# EAGLE design brake-light-tester (EAGLE 7.3.0)
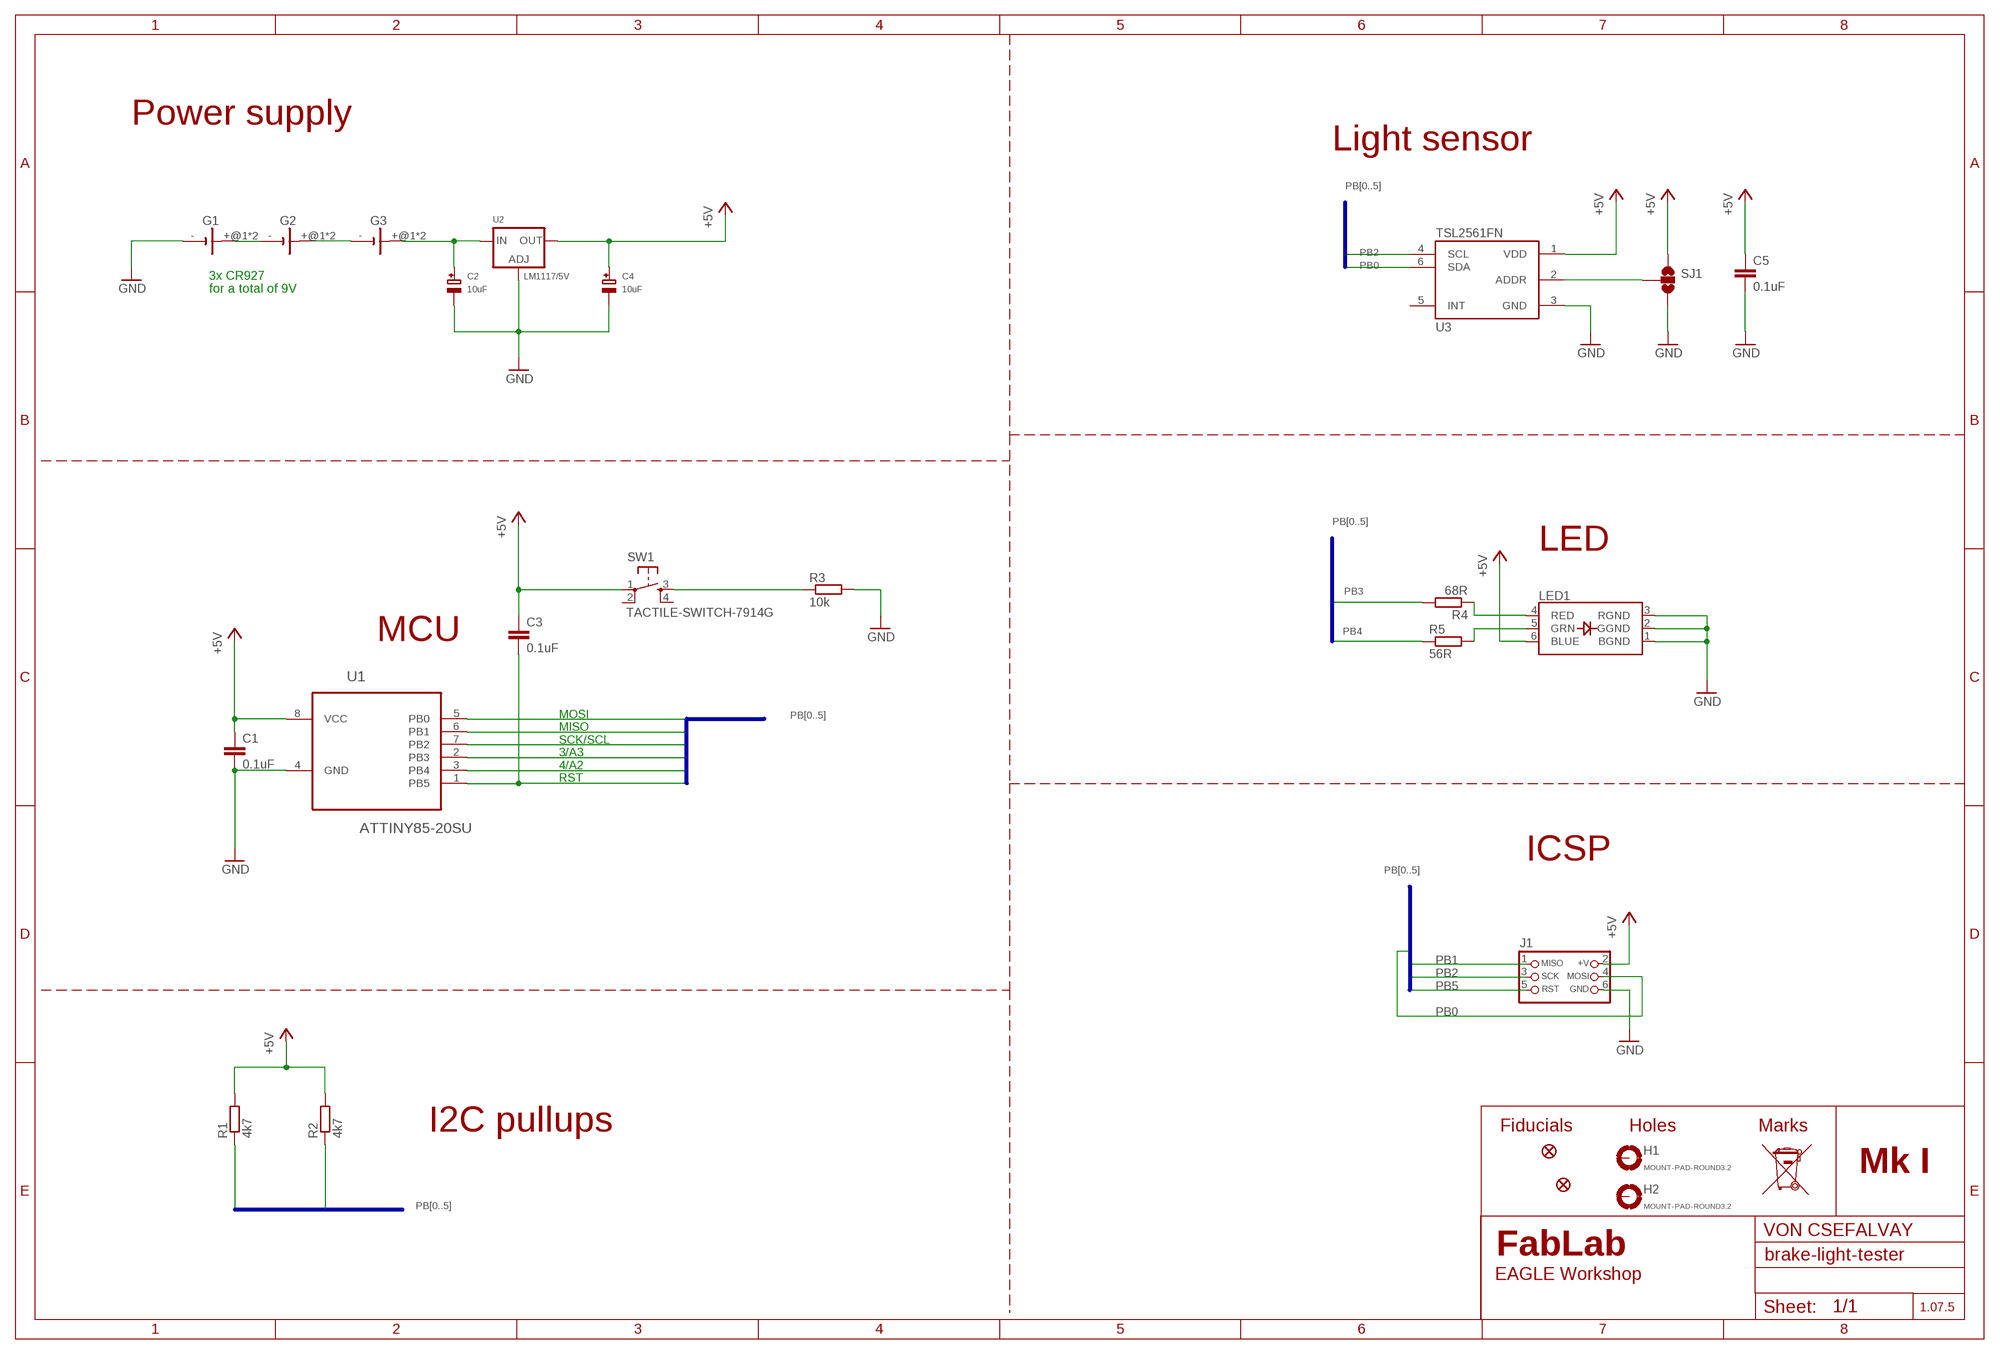
[diagram p0: schematic, sheet 1]

## Parts
C1  0.1uF  C-EUC1210  [C1210]
C2  10uF  CAP_TANTALUMC/6032_REFLOW  [EIA6032-28/C-R]
C3  0.1uF  C-EUC1206  [C1206]
C4  10uF  CAP_TANTALUMC/6032_REFLOW  [EIA6032-28/C-R]
C5  0.1uF  C-EUC1210  [C1210]
FID1  FIDUCIALROUND  [PASS-ROUND]
FID2  FIDUCIALROUND  [PASS-ROUND]
G1  10MM_SM_COIN_CELL_CLIP  [10MM_SM_COIN_CELL_CLIP]
G2  10MM_SM_COIN_CELL_CLIP  [10MM_SM_COIN_CELL_CLIP]
G3  10MM_SM_COIN_CELL_CLIP  [10MM_SM_COIN_CELL_CLIP]
H1  MOUNT-PAD-ROUND3.2  [3,2-PAD]
H2  MOUNT-PAD-ROUND3.2  [3,2-PAD]
J1  CON_HEADER_PRG_AVR_ICSP-SMD  [M2X3_SMD]
LED1  LED_RGB_PLCC6CREE-CLV6A  [RGBLED_PLCC6]
R1  4k7  R-EU_R1206  [R1206]
R2  4k7  R-EU_R1206  [R1206]
R3  10k  R-EU_R1206  [R1206]
R4  68R  R-EU_R1206  [R1206]
R5  56R  R-EU_R1206  [R1206]
SJ1  SOLDERJUMPER_2WAYPASTE1&2  [SJ_3_PASTE1&2]
SW1  TACTILE-SWITCH-7914G  [7914G]
U1  ATTINY85-20SU  [SOIC127P798X216-8N]
U2  LM1117/5V  LM1117SOT223-REFLOW  [SOT223-R]
U3  TSL2561FN  [FN-6]

## Nets
+5V: C1.1 C3.1 C4.+ C5.1 J1.2(+V) LED1.6(BLUE) R1.2 R2.2 SJ1.1 SW1.1 U1.8(VCC) U2.2(OUT) U3.1(VDD)
GND: C1.2 C2.- C4.- C5.2 G1.- J1.6(GND) LED1.1(BGND) LED1.2(GGND) LED1.3(RGND) R3.2 SJ1.3 U1.4(GND) U2.1(ADJ) U3.3(GND)
N$1: C2.+ G3.+@1(+) G3.+@2(+) U2.3(IN)
N$2: SJ1.2 U3.2(ADDR)
N$3: LED1.4(RED) R4.1
N$4: LED1.5(GRN) R5.2
N$5: G1.+@1(+) G1.+@2(+) G2.-
N$6: G2.+@1(+) G2.+@2(+) G3.-
N$7: R3.1 SW1.3
PB0: J1.4(MOSI) R1.1 U1.5(PB0) U3.6(SDA)
PB1: J1.1(MISO) U1.6(PB1)
PB2: J1.3(SCK) R2.1 U1.7(PB2) U3.4(SCL)
PB3: R4.2 U1.2(PB3)
PB4: R5.1 U1.3(PB4)
PB5: C3.2 J1.5(RST) U1.1(PB5)
Unconnected: H1.B3,2(MOUNT) H2.B3,2(MOUNT) SW1.2 SW1.4 U3.5(INT)

## Buses
PB[0..5]

## Notes on the sheet
- Power supply
- Light sensor
- 3x CR927
- for a total of 9V
- LED
- MCU
- MOSI
  MISO
  SCK/SCL
  3/A3
  4/A2
  RST
- ICSP
- I2C pullups | Fiducials | Holes | Marks
- Mk I
- VON CSEFALVAY
- FabLab
- EAGLE Workshop
- 1.07.5

## Library data of the parts
C1 C3 C5 = rcl:C-EU: CAPACITOR, European symbol; MF: TDK; MPN: CGA5L2C0G1H104J160AA; OC_FARNELL: 2211074
C2 C4 = microbuilder:CAP_TANTALUM: Tantalum Capacitors Wave footprints have larger pads and are meant to be used for hand soldering. Reflow footprints are optimised for solder paste and a reflow oven. EIA3216-18/A-[R/W] - Size A / 3216-18 / 1206 footprint 4.7µF 25V 10% Tantalum Capacitor 10µF 16V 10% Tantalum Capacitor [Digikey: 495-2236-2-ND] EIA3528-21/B-[R/W] - Size B / 3528-21 47µF 10V 10% Tantalum Capactior [Digikey: 495-2216-1-ND] EIA6032-28/C-[R/W] - Size C / 6032-28 10µF 35V 20% Tantalum Capacitor [Digikey: 495-2285-1-ND] 100µF 16V 10% Tantalum Capactior [Digikey: 399-5214-1-ND]; MF: AVX; MPN: TAJA106K010RNJ; OC_FARNELL: 197130
FID1 FID2 = microbuilder:FIDUCIAL: Fiducial Alignment Points Various fiducial points for machine vision alignment.; OC_FARNELL: unknown
G1-G3 = battery:10MM_SM_COIN_CELL_CLIP: Battery cell clip for CR927 Source: KEYSTONE ELECTRONICS CORP. www.keyelco.com, ASTORIA, N.Y. 11105-2017 PART ANME 10mm SM COIN CELl CLIP DWG NO. 3030; OC_FARNELL: unknown
H1 H2 = holes:MOUNT-PAD-ROUND: MOUNTING PAD, round; OC_FARNELL: unknown
J1 = dp_devices:CON_HEADER_PRG_AVR_ICSP: 2x3 AVR ICSP programming header; OC_FARNELL: unknown
LED1 = microbuilder:LED_RGB_PLCC6: RGB LED Cree CLV6A-FKB - Digikey: CLV6A-FKB-CK1P1G1BB7R3R3TR-ND DC Foreward Current: 20mA Foreward Voltage: R = 2.0, G = 3.2, B = 3.2 Viewing Angle: 120°; OC_FARNELL: unknown
R1 R2 = rcl:R-EU_: RESISTOR, European symbol; MF: MULTICOMP; MPN: MCHP06W2F4701T5E; OC_FARNELL: 1576638
R3 = rcl:R-EU_: RESISTOR, European symbol; MF: VISHAY DRALORIC; MPN: CRCW120610K0FKEA; OC_FARNELL: 1469970
R4 = rcl:R-EU_: RESISTOR, European symbol; MF: YAGEO (PHYCOMP); MPN: RL1206FR-7W0R68L; OC_FARNELL: 8067635
R5 = rcl:R-EU_: RESISTOR, European symbol; MF: PANASONIC ELECTRONIC COMPONENTS; MPN: ERJ8GEYJ560V; OC_FARNELL: 2057808
SJ1 = SparkFun-Retired:SOLDERJUMPER_2WAY: Solder Jumper 2 way solder jumper; OC_FARNELL: unknown
SW1 = GeekAmmo:TACTILE-SWITCH: Tactile Switch 4 Pins, SPST NO; OC_FARNELL: unknown
U1 = Atmel_By_element14_Batch_1-00:ATTINY85-20SU: 8-bit Microcontroller with In-System Programmable Flash; MF: ATMEL; MPN: ATTINY85-20SU; OC_FARNELL: 1455164; OC_NEWARK: 58M3797; PACKAGE: SOIC-8; SUPPLIER: Atmel
U2 = microbuilder:LM1117: LM1117 Voltage Regulator LM1117 Adjustable Voltage regulator [Digikey: LM1117IMP-ADJDKR-ND] LM1117 3.3V Voltage regulator [AP1117E33GDIDKR-ND] LM1117 5.0V Voltage regulator [AP1117E50GDIDKR-ND] SOT223-REFLOW - SOT223 package for solder paste/reflow ovens SOT223-WAVE - SOT223 package for hand-soldering (larger pads) Note: For the fixed-voltage regulators, simply set the ADJ pin to GND.; OC_FARNELL: unknown
U3 = SparkFun-DigitalIC:TSL2561: TSL2561 illumination sensor Approximates Human Eye Response Precisely Measures Illuminance Programmable Interrupt Function with User-Defined Upper and Lower Threshold 400 KHz I2C interface Programmable Analog Gain and Integration Time Supporting 1,000,000-to-1 Dynamic Range Automatically Rejects 50/60-Hz Lighting Ripple Low Active Power (0.75 mW Typical) with Power Down Mode RoHS Compliant The TSL2561 is a light-to-digital converter that transform light intensity to a digital signal output via I2C interface. The device combines one broadband photodiode (visible plus infrared) and one infrared-responding photodiode on a single CMOS integrated circuit capable of providing a near-photopic response over an effective 20-bit dynamic range (16-bit resolution). Two integrating ADCs convert the photodiode currents to a digital output that represents the irradiance measured on each channel. This digital output can be input to a microprocessor where illuminance (ambient light level) in lux is derived using an empirical formula to approximate the human eye response. The TSL2561 device supports a traditional level style interrupt that remains asserted until the firmware clears it.; OC_FARNELL: unknown; PROD_ID: IC-11791

## Board
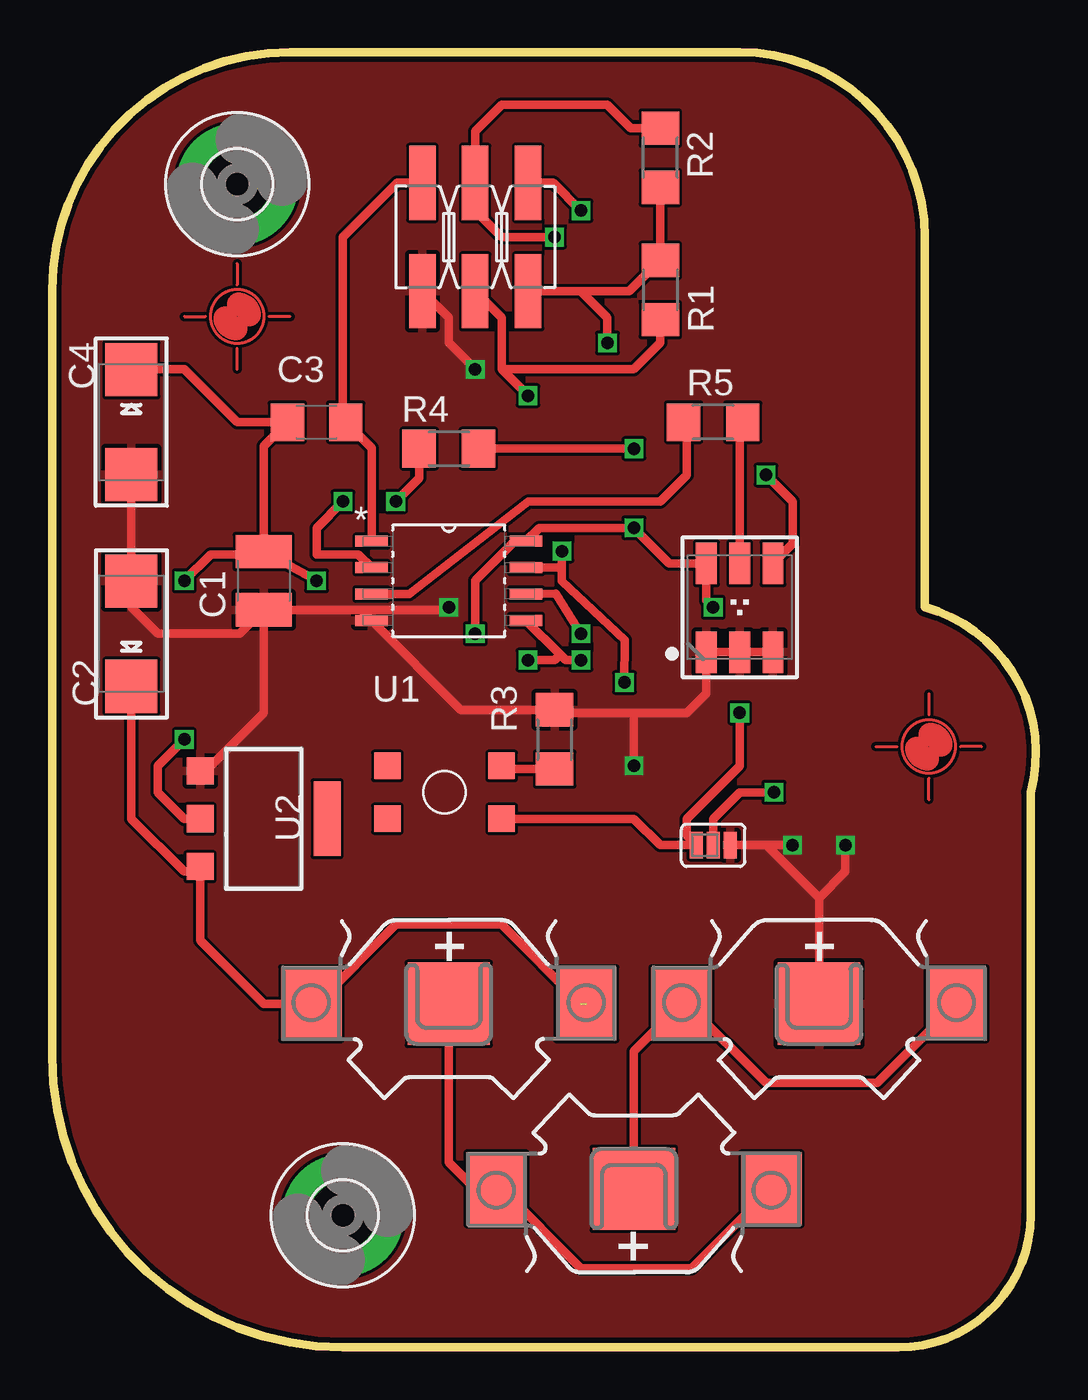
[diagram p1: board, top side]
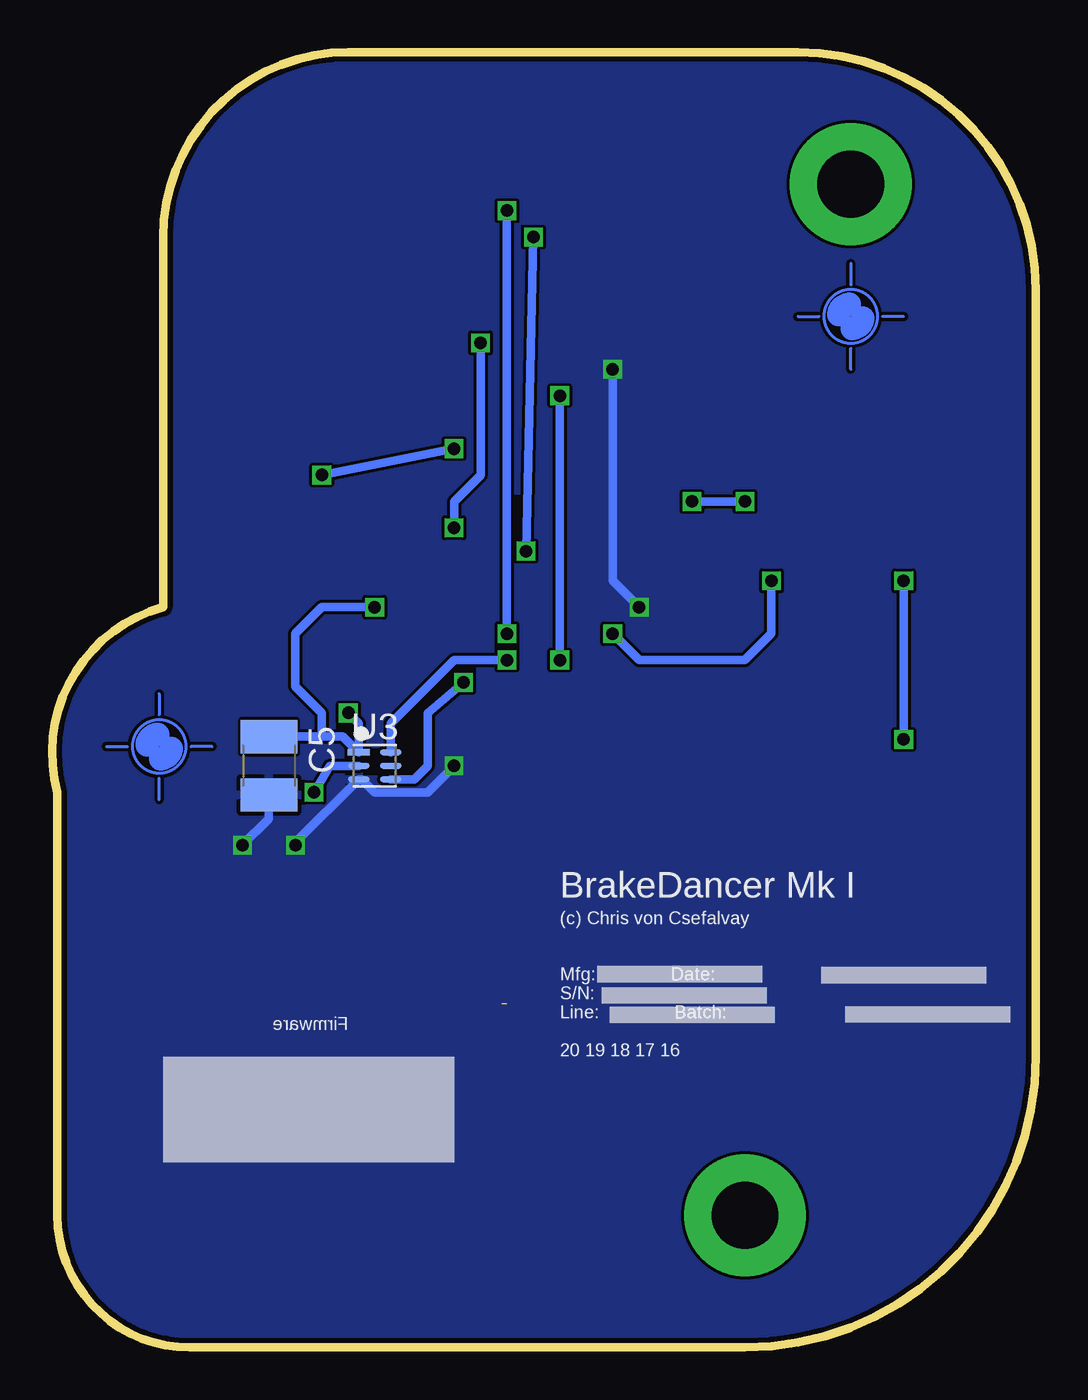
[diagram p2: board, bottom side, seen from below]

Size 47.24 x 62.23 mm. Coordinates in mm from the lower left corner, seen from the top.
Outline: 13.97,0 arc-90 0,13.97 0,50.8 arc-90 11.43,62.23 33.02,62.23 arc-90 41.91,53.34 41.91,35.56 arc-90 46.99,26.67 46.99,6.35 arc-90 40.64,0 13.97,0
Copper layers (1*16): Top 0.018mm / dielectric 1.55mm / Bottom 0.018mm
Design rules "eC_2Layer_PClass6_BaseCopperO18_eCDefault": minimum track width 0.15mm, minimum drill 0.35mm, track to track 0.15mm, track to pad 0.15mm, pad to pad 0.15mm, via to via 0.15mm, smd to smd 0mil, copper to edge 0.25mm, drill to drill 0.35mm, minimum pad ring 0.175mm, minimum via ring 0.125mm, stop-mask expansion 0mil, vias tented up to drill 0.45mm, thermal gap 0.2mm

### Footprints (pad centres in the part's own frame; a part is rotated, then mirrored left to right if it is on the bottom)
C1210 = smd 1.6 x 2.7: 1 -1.4,0; 2 1.4,0
EIA6032-28/C-R = smd 2.55 x 2.5: + 2.525,0; - -2.525,0
C1206 = smd 1.6 x 1.8: 1 -1.4,0; 2 1.4,0
10MM_SM_COIN_CELL_CLIP = smd 2.9 x 3.5: +@1 -6.6,0; +@2 6.6,0 | smd 3.96 x 3.96: - 0,0
3,2-PAD = drill 3.2 pad 5.842: B3,2 0,0
M2X3_SMD = smd 1.27 x 3.56: 1 -2.54,-2.605; 2 -2.54,2.605; 3 0,-2.605; 4 0,2.605; 5 2.54,-2.605; 6 2.54,2.605
RGBLED_PLCC6 = smd 1 x 2: 1 -1.6,-2.158; 2 0,-2.158; 3 1.6,-2.158; 4 1.6,2.108; 5 0,2.108; 6 -1.6,2.108
R1206 = smd 1.6 x 1.803: 1 -1.422,0; 2 1.422,0
SJ_3_PASTE1&2 = smd 0.635 x 1.27: 1 -0.813,0; 2 0,0; 3 0.813,0
7914G = smd 1.27 x 1.27: 1 0,0; 2 0,5.486; 3 2.54,0; 4 2.54,5.486
SOIC127P798X216-8N = smd 1.549 x 0.533: 1 -3.708,1.905; 2 -3.708,0.635; 3 -3.708,-0.635; 4 -3.708,-1.905; 5 3.708,-1.905; 6 3.708,-0.635; 7 3.708,0.635; 8 3.708,1.905
SOT223-R = smd 1.3 x 1.3: 1 -2.3,-3.05; 2 0,-3.05; 3 2.3,-3.05 | smd 3.6 x 1.3: 4 0,3.05
FN-6 = smd 1.05 x 0.3: 1 -0.775,0.65; 2 -0.775,0; 3 -0.775,-0.65; 4 0.775,-0.65; 5 0.775,0; 6 0.775,0.65

### Placement (x,y rotation side)
C1  10.16,36.83 270 top
C2  3.81,34.29 270 top
C3  12.7,44.45 0 top
C4  3.81,44.45 90 top
C5  36.83,27.94 270 bottom
DRILEGEND  [DRILEGEND]  -9.3,-10.91 0 top  (outside the outline)
FID1  42.1,28.86 0 top
FID2  8.89,49.53 0 top
G1  36.83,16.51 0 top
G2  27.94,7.62 180 top
G3  19.05,16.51 0 top
H1  8.89,55.88 0 top
H2  13.97,6.35 0 top
J1  20.32,53.34 180 top
LED1  33.02,35.56 0 top
R1  29.21,50.8 90 top
R2  29.21,57.15 270 top
R3  24.13,29.21 90 top
R4  19.05,43.18 180 top
R5  31.75,44.45 0 top
SJ1  31.75,24.13 0 top
SW1  21.59,25.4 90 top
U1  19.05,36.83 0 top
U2  10.16,25.4 270 top
U3  31.75,27.94 0 bottom

### Tracks (layer width: path | path; a pad name or v marks a point on that pad's centre or on a via)
+5V  (via drill 0.6)
  Top 0.406: SW1.1 27.94,25.4 29.21,24.13 SJ1.1 30.48,24.59 30.48,25.4 33.02,27.94 v33.02,30.48 | C4.+ 3.83,46.99 6.35,46.99 8.89,44.45 C3.1 10.16,43.31 C1.1 | R2.2 R1.2 27.72,50.73 25.4,50.73 | 25.4,50.73 J1.2 | U2.2 6.35,25.4 5.08,26.67 5.08,27.94 v6.35,29.21 | v6.35,36.83 7.62,38.1 10.03,38.1 C1.1 | v26.67,48.26 26.67,49.47 25.4,50.73 | v31.75,35.56 31.42,35.89 LED1.6 29.64,37.67 v27.94,39.37 23.39,39.37 U1.8 22.23,38.73 20.32,36.83 v20.32,34.29 | v12.7,36.83 C1.1
  Bottom 0.406: v6.35,29.21 v6.35,36.83 | v27.94,39.37 27.94,40.64 26.67,41.91 v26.67,48.26 | C5.1 34.29,29.34 | 34.29,29.34 33.27,29.34 U3.1 32.52,29.98 v33.02,30.48 | v31.75,35.56 34.29,35.56 35.56,34.29 35.56,31.75 34.29,30.48 34.29,29.34 | v20.32,34.29 19.05,33.02 13.97,33.02 12.7,34.29 v12.7,36.83
GND  (via drill 0.6)
  Top 0.406: G1.- 36.83,21.59 | 36.83,21.59 34.29,24.13 SJ1.3 v35.56,24.13 | C4.- C2.- 3.81,35.56 5.08,34.29 9.02,34.29 C1.2 | 27.94,30.48 24.28,30.48 R3.2 19.63,30.63 U1.4 14.84,35.43 | 27.94,30.48 30.48,30.48 31.42,31.42 LED1.1 LED1.2 LED1.3 | 14.84,35.43 C1.2 | 14.84,35.43 18.92,35.43 v19.05,35.56 | v20.32,46.99 19.05,48.26 19.05,49.47 J1.6 | v38.1,24.13 38.1,22.86 36.83,21.59 | v27.94,27.94 27.94,30.48 | U2.1 7.38,27.7 10.16,30.48 C1.2
  Bottom 0.406: v19.05,35.56 20.32,36.83 v20.32,46.99 | C5.2 36.83,25.4 v38.1,24.13 | v27.94,27.94 29.21,26.67 31.75,26.67 32.37,27.29 U3.3 35.56,24.25 v35.56,24.13
  pour Top: -6.35,64.77 -6.35,6.35 3.81,-3.81 44.45,-3.81 45.72,-3.81 53.34,3.81 53.34,57.15 45.72,64.77
  pour Bottom: -6.35,62.23 -6.35,5.08 0,-1.27 46.99,-1.27 48.26,0 48.26,10.16 53.34,15.24 53.34,55.88 41.91,67.31 -1.27,67.31
N$1  (1 unrouted)
  Top 0.406: C2.+ 3.81,25.4 6.35,22.86 6.87,22.86 U2.3 7.11,19.56 10.16,16.51 G3.+@1 12.7,16.51 16.51,20.32 21.59,20.32 25.4,16.51
N$2  (via drill 0.6)
  Top 0.406: SJ1.2 31.75,25.4 33.02,26.67 v34.67,26.67
  Bottom 0.406: v34.67,26.67 33.9,27.94 U3.2
N$3  (via drill 0.6)
  Top 0.406: R4.1 v27.94,43.18 | v34.29,41.91 35.56,40.64 35.56,38.61 LED1.4
  Bottom 0.406: v27.94,43.18 v34.29,41.91
N$4
  Top 0.406: R5.2 33.02,44.3 LED1.5
N$5
  Top 0.406: G2.- 27.94,14.22 G1.+@1 30.48,16.51 34.29,12.7 39.62,12.7 G1.+@2
N$6
  Top 0.406: G3.- 19.05,8.89 20.32,7.62 G2.+@2 21.59,7.62 25.4,3.81 30.73,3.81 G2.+@1
N$7
  Top 0.406: SW1.3 21.74,27.79 R3.1
PB0  (via drill 0.6)
  Top 0.406: R1.1 29.21,48.26 27.94,46.99 21.59,46.99 | 21.59,46.99 21.59,49.47 J1.4 | v25.4,33.02 24.66,33.02 24.4,33.29 | 24.4,33.29 U1.5 | 21.59,46.99 v22.86,45.72 | v22.86,33.02 24.13,33.02 24.4,33.29
  Bottom 0.406: U3.6 30.98,29.98 27.94,33.02 v25.4,33.02 | v22.86,45.72 v22.86,33.02
PB1  (via drill 0.6)
  Top 0.406: J1.1 24.06,55.95 v25.4,54.61 | v25.4,34.29 24.2,36.21 U1.6
  Bottom 0.406: v25.4,54.61 v25.4,34.29
PB2  (via drill 0.6)
  Top 0.406: R2.1 27.79,58.57 26.67,59.69 21.59,59.69 20.32,58.42 J1.3 20.32,54.61 21.59,53.34 v24.13,53.34 | v27.49,31.95 27.49,33.98 24.48,36.82 | 24.48,36.82 24.49,37.46 U1.7 | v24.48,38.25 24.48,36.82
  Bottom 0.406: U3.4 29.86,27.29 29.21,27.94 29.21,30.48 v27.49,31.95 | v24.13,53.34 v24.48,38.25
PB3  (via drill 0.6)
  Top 0.406: R4.2 17.63,41.76 v16.51,40.64 | v13.97,40.64 12.7,39.37 12.7,38.1 14.71,38.1 U1.2
  Bottom 0.406: v16.51,40.64 v13.97,40.64
PB4
  Top 0.406: U1.3 17.14,36.2 22.86,40.64 29.21,40.64 30.48,41.91 30.48,44.3 R5.1
PB5
  Top 0.406: U1.1 15.34,43.21 C3.2 13.97,44.58 13.97,53.34 16.58,55.95 J1.5

### Text on the board
_tsilk: BrakeDancer Mk I | 0x49 / 0x39 / 0x29 | CR927 / x 3
_bsilk: BrakeDancer Mk I | (c) Chris von Csefalvay | Firmware | Mfg: Date: / S/N: / Line: Batch: / / 20 19 18 17 16
DrillLegend: LAYER-STACK
DrillLegend_01-16: 01-16